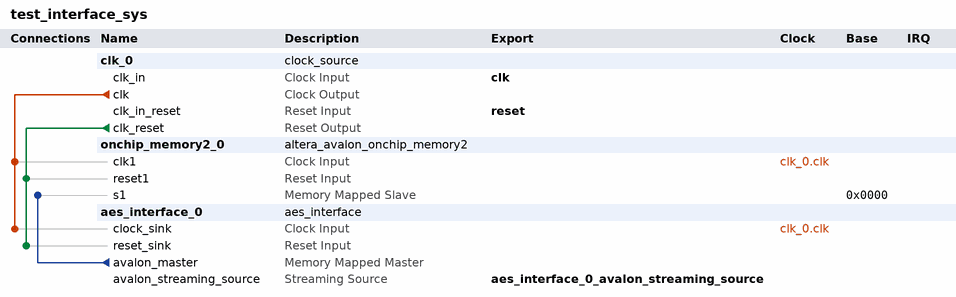
[diagram p0: system contents]
# Platform Designer (Qsys) system test_interface_sys, MAX 10 10M50DAF484C7G
# Parameters at their usual value, and those the tool derives, are not listed.
package require -exact qsys 18.0
create_system test_interface_sys
set_project_property DEVICE_FAMILY {MAX 10}
set_project_property DEVICE 10M50DAF484C7G

add_instance clk_0 clock_source 18.0
set_instance_parameter_value clk_0 clockFrequency 50000000

add_instance onchip_memory2_0 altera_avalon_onchip_memory2 18.0
set_instance_parameter_value onchip_memory2_0 dataWidth 128
set_instance_parameter_value onchip_memory2_0 dualPort false
set_instance_parameter_value onchip_memory2_0 initMemContent true
set_instance_parameter_value onchip_memory2_0 initializationFileName {C:/Users/test/Desktop/GitLab/AES/AES ModelSim/onchip_mem.hex}
set_instance_parameter_value onchip_memory2_0 memorySize 128
set_instance_parameter_value onchip_memory2_0 useNonDefaultInitFile true
set_instance_parameter_value onchip_memory2_0 writable false

add_instance aes_interface_0 aes_interface 1.0

# connections
add_connection clk_0.clk aes_interface_0.clock_sink clock
add_connection clk_0.clk onchip_memory2_0.clk1 clock
add_connection clk_0.clk_reset aes_interface_0.reset_sink reset
add_connection clk_0.clk_reset onchip_memory2_0.reset1 reset
add_connection aes_interface_0.avalon_master onchip_memory2_0.s1 avalon
set_connection_parameter_value aes_interface_0.avalon_master/onchip_memory2_0.s1 baseAddress 0x0000

# exported interfaces
add_interface aes_interface_0_avalon_streaming_source avalon_streaming source
set_interface_property aes_interface_0_avalon_streaming_source EXPORT_OF aes_interface_0.avalon_streaming_source
add_interface clk clock sink
set_interface_property clk EXPORT_OF clk_0.clk_in
add_interface reset reset sink
set_interface_property reset EXPORT_OF clk_0.clk_in_reset

set_interconnect_requirement {$system} qsys_mm.clockCrossingAdapter HANDSHAKE
set_interconnect_requirement {$system} qsys_mm.enableEccProtection FALSE
set_interconnect_requirement {$system} qsys_mm.insertDefaultSlave FALSE
set_interconnect_requirement {$system} qsys_mm.maxAdditionalLatency 1

save_system test_interface_sys.qsys
